# Altium project bt2.PrjPcb
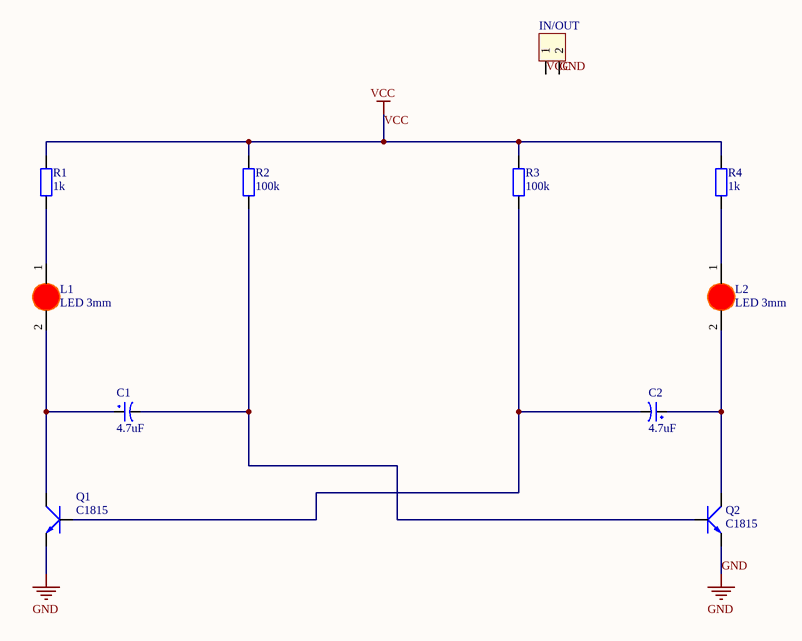
[diagram p0: schematic.SchDoc]
1 sheet, 11 parts. Net scope: global (net labels, ports and power ports of the same name join across sheets).
Board file: PCB.PcbDoc

## Sheet schematic.SchDoc
size A; SheetNumber: 1; SheetTotal: 1

### Parts
C1  4.7uF  [tu hoa 8mm]
C2  4.7uF  [tu hoa 8mm]
IN/OUT  Header 2  [HED2]  (value not drawn)
L1  LED 3mm  [LED-3MM-RED]
L2  LED 3mm  [LED-3MM-RED]
Q1  C1815  [QTO-92]
Q2  C1815  [QTO-92]
R1  1k  [tro vach 1/4w]
R2  100k  [tro vach 1/4w]
R3  100k  [tro vach 1/4w]
R4  1k  [tro vach 1/4w]

### Nets
GND: IN/OUT.2 Q1.1(E) Q2.1(E)
VCC: IN/OUT.1 R1.2 R2.2 R3.2 R4.2
NetC1_1: C1.1 L1.2(K) Q1.2(C)
NetC1_2: C1.2 Q2.3(B) R2.1
NetC2_1: C2.1 L2.2(K) Q2.2(C)
NetC2_2: C2.2 Q1.3(B) R3.1
NetL1_1: L1.1(A) R1.1
NetL2_1: L2.1(A) R4.1

### Library data of the parts
C1 C2 = Tu Hoa 4.7uF 400V 8x12: Cắm; Don_Vi: Con; So_Chan: 2; Ten_Linh_Kien: Tụ Hóa 4.7uF 400V 8x12MM; Ma_Hang: MH003744; Chung_Loai: Cắm; Kieu_Chan: *
IN/OUT = Hed2: Header 2 (Green); Value: Header 2
L1 L2 = LED 3mm Do: Cắm; Don_Vi: Con; Ma_Hang: MH003892; Ten_Linh_Kien: Led 3MM Phủ Đỏ (10c); Ghi_Chu: *; Kieu_Chan: *; Chung_Loai: Cắm
Q1 Q2 = C1815: NPN 600mW, ECB; Value: C1815
R1 R4 = Tro Vach 1/4W 5% 1k: Cắm; Don_Vi: Con; So_Chan: 2; Ten_Linh_Kien: Trở Vạch 1/4w 5% 1k; Ma_Hang: MH007390; Chung_Loai: Cắm; Kieu_Chan: *
R2 R3 = Tro Vach 1/4W 5% 100k: Cắm; Don_Vi: Con; So_Chan: 2; Ten_Linh_Kien: Trở Vạch 1/4w 5% 100k; Ma_Hang: MH007352; Chung_Loai: Cắm; Kieu_Chan: *